# EAGLE design SWM050_TSOP8 (EAGLE 7.5.0)
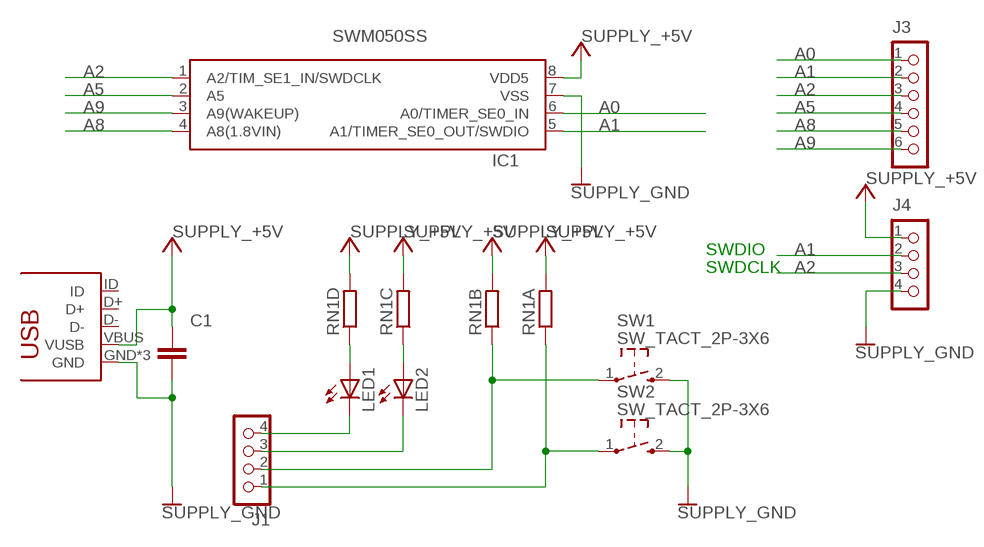
[diagram p0: schematic, sheet 1]

## Parts
C1  CAPACITOR_NPOL-0603  [C603]
IC1  SWM050I2P7""  [TSOP8_065]
J1  CON_HEADER_1X04  [M1X4]
J3  CON_HEADER_1X06-PTH  [M1X6]
J4  CON_HEADER_1X04  [M1X4]
LED1  LED-0603  [LED-603]
LED2  LED-0603  [LED-603]
RN1  RESISTOR_ARRAY_4  [RN8P-4R-CRA06S]
SW1  SW_TACT_2P-3X6  [SW_TACT_3X6]
SW2  SW_TACT_2P-3X6  [SW_TACT_3X6]
U$1  CON_USB_MICRO_SMD  [MICRO_USB_SMD]

## Nets
+5V: C1.1 IC1.8(VDD5) J4.1 RN1.5 RN1.6 RN1.7 RN1.8 U$1.VBUS(VUSB) ; supply symbol labelled SUPPLY_+5V
A0: IC1.6(A0/TIMER_SE0_IN) J3.1
A1: IC1.5(A1/TIMER_SE0_OUT/SWDIO) J3.2 J4.2
A2: IC1.1(A2/TIM_SE1_IN/SWDCLK) J3.3 J4.3
A5: IC1.2(A5) J3.4
A8: IC1.4(A8(1.8VIN)) J3.5
A9: IC1.3(A9(WAKEUP)) J3.6
GND: C1.2 IC1.7(VSS) J4.4 SW1.2 SW2.2 U$1.GND U$1.P$2(GND) U$1.P$3(GND) ; supply symbol labelled SUPPLY_GND
N$1: LED1.A RN1.4
N$2: LED2.A RN1.3
N$3: J1.2 RN1.2 SW1.1
N$4: J1.1 RN1.1 SW2.1
N$5: J1.3 LED2.C
N$6: J1.4 LED1.C
Unconnected: U$1.D+ U$1.D- U$1.ID

## Notes on the sheet
- SWDIO
- SWDCLK

## Library data of the parts
C1 = dp_devices.v6:CAPACITOR_NPOL: Non-Polarized capacitor in various packages
IC1 = gd32:SWM050I2P7
J1 J4 = dp_devices.v6:CON_HEADER_1X04
J3 = dp_devices.v6:CON_HEADER_1X06
LED1 LED2 = dp_devices.v6:LED: Light Emitting Diode
RN1 = dp_devices.v6:RESISTOR_ARRAY_4: 4 Resistor Array 0603
SW1 SW2 = diver:SW_TACT_2P
U$1 = gd32:CON_USB

## Board
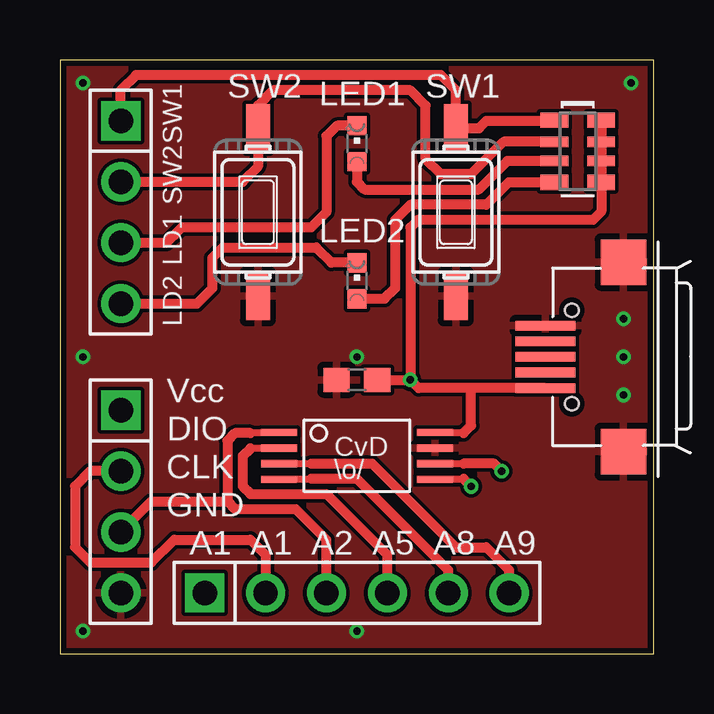
[diagram p1: board, top side]
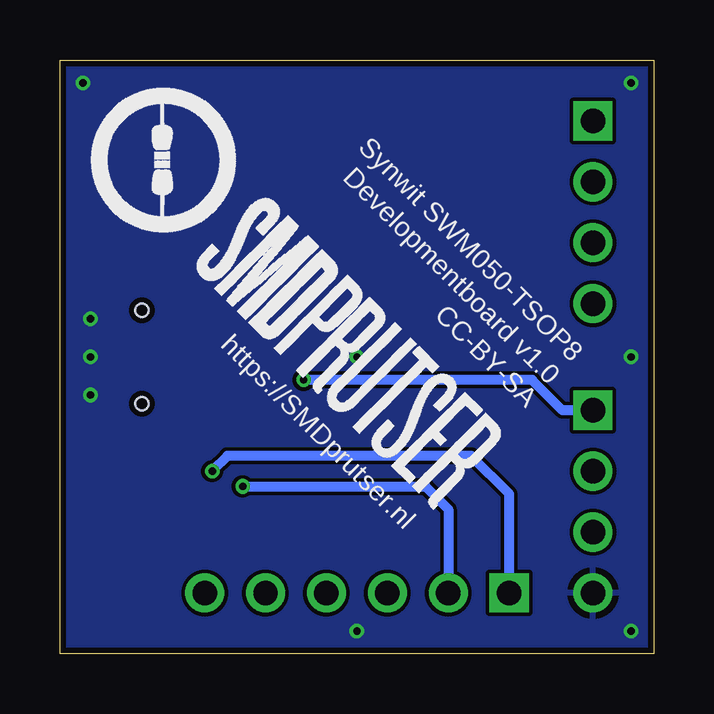
[diagram p2: board, bottom side, seen from below]

Size 24.77 x 24.77 mm. Coordinates in mm from the lower left corner, seen from the top.
Outline: 0,0 24.77,0 24.77,24.77 0,24.77 0,0
Copper layers (1*16): Top 0.035mm / dielectric 1.5mm / Bottom 0.035mm
Design rules "dirt_cheap_dirty_boards.v1.1": minimum track width 5mil, minimum drill 12mil, track to track 6mil, track to pad 6mil, pad to pad 6mil, via to via 6mil, smd to smd 0mil, copper to edge 10mil, drill to drill 10mil, minimum pad ring 10mil, minimum via ring 6mil, stop-mask expansion 2mil, vias tented up to drill 25mil, thermal gap 10mil

### Footprints (pad centres in the part's own frame; a part is rotated, then mirrored left to right if it is on the bottom)
C603 = smd 1.1 x 1: 1 -0.85,0; 2 0.85,0
TSOP8_065 = smd 1.5 x 0.3: 1 -3.25,0.975; 2 -3.25,0.325; 3 -3.25,-0.325; 4 -3.25,-0.975; 5 3.25,-0.975; 6 3.25,-0.325; 7 3.25,0.325; 8 3.25,0.975
M1X4 = drill 1.02 pad 1.632 square: 1 0,0 | drill 1.02 pad 1.632: 2 2.54,0; 3 5.08,0; 4 7.62,0
M1X6 = drill 1.02 pad 1.632 square: 1 0,0 | drill 1.02 pad 1.632: 2 2.54,0; 3 5.08,0; 4 7.62,0; 5 10.16,0; 6 12.7,0
LED-603 = smd 0.8 x 0.8: A 0,-0.75; C 0,0.75
RN8P-4R-CRA06S = smd 0.63 x 1.15: 1 -1.295,-0.975; 4 1.295,-0.975; 5 1.295,0.975; 8 -1.295,0.975 | smd 0.44 x 1.15: 2 -0.4,-0.975; 3 0.4,-0.975; 6 0.4,0.975; 7 -0.4,0.975
SW_TACT_3X6 = smd 2 x 1: 1 -3.5,0; 2 3.5,0
MICRO_USB_SMD = smd 0.4 x 2.5: D+ 0,3.25; D- -0.65,3.25; GND 1.3,3.25; ID 0.65,3.25; VBUS -1.3,3.25 | smd 1.9 x 1.9: P$2 -3.95,0; P$3 3.95,0 | hole 0.55: -1.95,2.15; 1.95,2.15

### Placement (x,y rotation side)
C1  12.38,11.43 180 top
IC1  12.38,8.26 0 top
J1  2.54,22.23 270 top
J3  6.03,2.54 0 top
J4  2.54,10.16 270 top
LED1  12.38,15.56 0 top
LED2  12.38,21.27 0 top
RN1  21.59,20.95 270 top
SW1  8.26,18.41 270 top
SW2  16.51,18.41 270 top
U$1  23.5,12.38 90 top
U$2  [SMDPRUTSER_LOGO_1INCH]  27.85,20.41 315 bottom  (outside the outline)

### Tracks (layer width: path | path; a pad name or v marks a point on that pad's centre or on a via)
+5V  (via drill 0.3)
  Top 0.305: IC1.8 16.83,9.21
  Top 0.406: C1.1 v14.61,11.43 | U$1.VBUS 17.14,11.08 | 17.14,11.08 14.95,11.08 v14.61,11.43 | 16.83,9.21 17.14,9.53 17.14,11.08 | RN1.8 RN1.7 RN1.6 RN1.5 22.57,18.44 22.23,18.1 14.92,18.1 14.61,17.78 v14.61,11.43
  Bottom 0.406: v14.61,11.43 5.08,11.43 3.81,10.16 J4.1
A0  (via drill 0.3)
  Top 0.305: 16.83,7.94 IC1.6
  Top 0.406: v18.41,7.62 18.1,7.94 16.83,7.94
  Bottom 0.406: J3.1 6.03,6.67 7.62,8.26 17.78,8.26 v18.41,7.62
A1  (via drill 0.3)
  Top 0.305: IC1.5 16.83,7.3
  Top 0.406: 16.83,7.3 v17.14,6.99 | J4.2 1.27,7.62 0.64,6.99 0.64,4.45 1.27,3.81 3.81,3.81 4.76,4.76 7.94,4.76 8.57,4.13 J3.2
  Bottom 0.406: v17.14,6.99 9.53,6.99 8.57,6.03 J3.2
A2
  Top 0.305: IC1.1 7.94,9.21
  Top 0.406: J3.3 11.11,4.76 9.84,6.03 7.3,6.03 6.99,6.35 | 6.99,6.35 6.99,8.89 7.3,9.21 7.94,9.21 | J4.3 3.81,6.35 6.99,6.35
A5
  Top 0.305: IC1.2 7.94,8.57
  Top 0.406: 7.94,8.57 7.62,8.26 7.62,6.99 7.94,6.67 11.11,6.67 13.65,4.13 J3.4
A8
  Top 0.305: 10.48,7.3 IC1.4
  Top 0.406: J3.5 16.19,3.49 12.38,7.3 10.48,7.3
A9
  Top 0.305: IC1.3 10.48,7.94
  Top 0.406: J3.6 18.73,3.49 17.78,4.45 16.51,4.45 13.02,7.94 10.48,7.94
GND  (via drill 0.3)
  other vias: 23.5,13.97 23.5,12.38 23.5,10.79 0.95,12.38 0.95,23.81 0.95,0.95 23.81,23.81 12.38,0.95 12.38,12.38
  pour Top: 0,24.77 24.77,24.77 24.77,0 0,0
  pour Bottom: 0,24.77 24.77,24.77 24.77,0 0,0
N$1
  Top 0.406: LED1.A 13.54,14.81 13.97,15.24 13.97,18.1 14.61,18.73 17.78,18.73 18.71,19.66 RN1.4
N$2
  Top 0.406: LED2.A 12.38,19.68 12.7,19.37 17.46,19.37 18.65,20.55 RN1.3
N$3
  Top 0.406: RN1.2 18.5,21.36 17.14,20 15.88,20 15.24,20.64 15.24,22.86 14.61,23.5 8.89,23.5 8.26,22.86 SW1.1 8.26,20.32 7.62,19.68 J1.2
N$4
  Top 0.406: RN1.1 20.59,22.23 17.78,22.23 17.47,21.91 SW2.1 16.51,23.5 15.88,24.13 3.17,24.13 2.54,23.5 J1.1
N$5
  Top 0.406: LED2.C 11.54,22.02 11.11,21.59 11.11,18.41 10.48,17.78 5.08,17.78 4.76,17.46 4.45,17.14 J1.3
N$6
  Top 0.406: LED1.C 11.31,16.31 10.68,16.94 6.78,16.94 6.35,16.51 6.35,15.24 5.71,14.61 J1.4

### Text on the board
tPlace: SW2 | LED1 | SW1 | SW1 | SW2 | LED2 | LD1 | LD2 | Vcc | DIO | CvD | CLK | \\o/ | GND | A1 | A1 | A2 | A5 | A8 | A9
bPlace: Synwit SWM050-TSOP8 | Developmentboard v1.0 | CC-BY-SA | https://SMDprutser.nl
tStop: SWM050-8 | 20180331